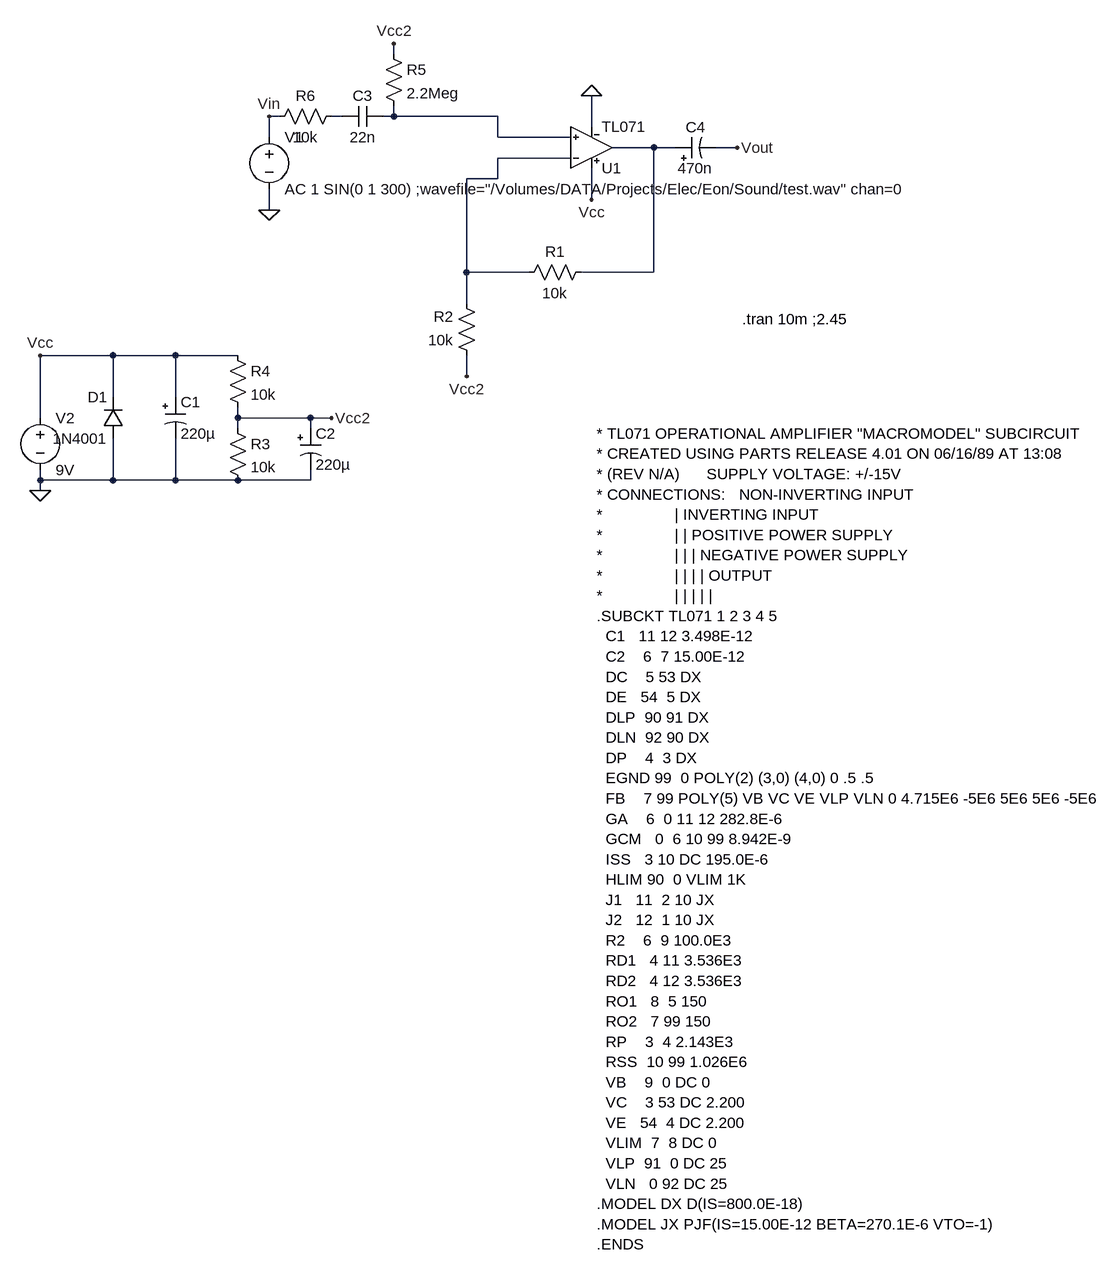
[diagram p0: schematic By2.asc]
By2.asc, the LTspice schematic file:
Version 4
SHEET 1 1308 1608
WIRE 224 128 224 112
WIRE 48 224 32 224
WIRE 144 224 128 224
WIRE 224 224 224 208
WIRE 224 224 208 224
WIRE 384 224 224 224
WIRE 528 240 528 192
WIRE 32 256 32 224
WIRE 384 256 384 224
WIRE 496 256 384 256
WIRE 624 272 560 272
WIRE 656 272 624 272
WIRE 752 272 720 272
WIRE 496 288 384 288
WIRE 384 320 384 288
WIRE 384 320 336 320
WIRE 528 352 528 304
WIRE 32 368 32 336
WIRE 336 464 336 320
WIRE 432 464 336 464
WIRE 624 464 624 272
WIRE 624 464 512 464
WIRE 336 512 336 464
WIRE -208 592 -320 592
WIRE -112 592 -208 592
WIRE -16 592 -112 592
WIRE 336 624 336 592
WIRE -208 656 -208 592
WIRE -112 656 -112 592
WIRE -320 688 -320 592
WIRE -16 688 -16 672
WIRE 96 688 -16 688
WIRE 128 688 96 688
WIRE -16 704 -16 688
WIRE 96 704 96 688
WIRE -320 784 -320 768
WIRE -208 784 -208 720
WIRE -208 784 -320 784
WIRE -112 784 -112 720
WIRE -112 784 -208 784
WIRE -16 784 -112 784
WIRE 96 784 96 768
WIRE 96 784 -16 784
WIRE -320 800 -320 784
FLAG 32 368 0
FLAG -320 800 0
FLAG -320 592 Vcc
FLAG 528 192 0
FLAG 528 352 Vcc
FLAG 752 272 Vout
FLAG 32 224 Vin
FLAG 336 624 Vcc2
FLAG 128 688 Vcc2
FLAG 224 112 Vcc2
SYMBOL voltage 32 240 R0
SYMATTR InstName V1
SYMATTR Value AC 1 SIN(0 1 300) ;wavefile="/Volumes/DATA/Projects/Elec/Eon/Sound/test.wav" chan=0
SYMBOL voltage -320 672 R0
SYMATTR InstName V2
SYMATTR Value 9V
SYMBOL res 528 448 R90
WINDOW 0 0 56 VBottom 2
WINDOW 3 32 56 VTop 2
SYMATTR InstName R1
SYMATTR Value 10k
SYMBOL res 352 608 R180
WINDOW 0 36 76 Left 2
WINDOW 3 36 40 Left 2
SYMATTR InstName R2
SYMATTR Value 10k
SYMBOL res -32 688 R0
SYMATTR InstName R3
SYMATTR Value 10k
SYMBOL res -32 576 R0
SYMATTR InstName R4
SYMATTR Value 10k
SYMBOL res 208 112 R0
SYMATTR InstName R5
SYMATTR Value 2.2Meg
SYMBOL res 144 208 R90
WINDOW 0 0 56 VBottom 2
WINDOW 3 32 56 VTop 2
SYMATTR InstName R6
SYMATTR Value 10k
SYMBOL diode -192 720 R180
WINDOW 0 24 64 Left 2
WINDOW 3 24 0 Left 2
SYMATTR InstName D1
SYMATTR Value 1N4001
SYMBOL polcap -128 656 R0
SYMATTR InstName C1
SYMATTR Value 220µ
SYMBOL polcap 80 704 R0
SYMATTR InstName C2
SYMATTR Value 220µ
SYMBOL cap 208 208 R90
WINDOW 0 0 32 VBottom 2
WINDOW 3 32 32 VTop 2
SYMATTR InstName C3
SYMATTR Value 22n
SYMBOL polcap 656 288 R270
WINDOW 0 32 32 VTop 2
WINDOW 3 0 32 VBottom 2
SYMATTR InstName C4
SYMATTR Value 470n
SYMBOL TL071bis 528 336 M180
SYMATTR InstName U1
SYMATTR SpiceModel ""
TEXT 760 536 Left 2 !.tran 10m ;2.45
TEXT 536 712 Left 2 !* TL071 OPERATIONAL AMPLIFIER "MACROMODEL" SUBCIRCUIT\n* CREATED USING PARTS RELEASE 4.01 ON 06/16/89 AT 13:08\n* (REV N/A)      SUPPLY VOLTAGE: +/-15V\n* CONNECTIONS:   NON-INVERTING INPUT\n*                | INVERTING INPUT\n*                | | POSITIVE POWER SUPPLY\n*                | | | NEGATIVE POWER SUPPLY\n*                | | | | OUTPUT\n*                | | | | |\n.SUBCKT TL071 1 2 3 4 5\n  C1   11 12 3.498E-12\n  C2    6  7 15.00E-12\n  DC    5 53 DX\n  DE   54  5 DX\n  DLP  90 91 DX\n  DLN  92 90 DX\n  DP    4  3 DX\n  EGND 99  0 POLY(2) (3,0) (4,0) 0 .5 .5\n  FB    7 99 POLY(5) VB VC VE VLP VLN 0 4.715E6 -5E6 5E6 5E6 -5E6\n  GA    6  0 11 12 282.8E-6\n  GCM   0  6 10 99 8.942E-9\n  ISS   3 10 DC 195.0E-6\n  HLIM 90  0 VLIM 1K\n  J1   11  2 10 JX\n  J2   12  1 10 JX\n  R2    6  9 100.0E3\n  RD1   4 11 3.536E3\n  RD2   4 12 3.536E3\n  RO1   8  5 150\n  RO2   7 99 150\n  RP    3  4 2.143E3\n  RSS  10 99 1.026E6\n  VB    9  0 DC 0\n  VC    3 53 DC 2.200\n  VE   54  4 DC 2.200\n  VLIM  7  8 DC 0\n  VLP  91  0 DC 25\n  VLN   0 92 DC 25\n.MODEL DX D(IS=800.0E-18)\n.MODEL JX PJF(IS=15.00E-12 BETA=270.1E-6 VTO=-1)\n.ENDS

The netlist it stands for:
* By2.asc
V1 Vin 0 AC 1 SIN(0 1 300) ;wavefile="/Volumes/DATA/Projects/Elec/Eon/Sound/test.wav" chan=0
V2 Vcc 0 9V
R1 N003 N004 10k
R2 Vcc2 N004 10k
R3 Vcc2 0 10k
R4 Vcc Vcc2 10k
R5 Vcc2 N002 2.2Meg
R6 N001 Vin 10k
D1 0 Vcc 1N4001
C1 Vcc 0 220µ
C2 Vcc2 0 220µ
C3 N002 N001 22n
C4 N003 Vout 470n
XU1 N002 N004 Vcc 0 N003 TL071  ; pins In+ In- V+ V- OUT
.model D D
.lib standard.dio
.tran 10m ;2.45
* TL071 OPERATIONAL AMPLIFIER "MACROMODEL" SUBCIRCUIT
* CREATED USING PARTS RELEASE 4.01 ON 06/16/89 AT 13:08
* (REV N/A)      SUPPLY VOLTAGE: +/-15V
* CONNECTIONS:   NON-INVERTING INPUT
*                | INVERTING INPUT
*                | | POSITIVE POWER SUPPLY
*                | | | NEGATIVE POWER SUPPLY
*                | | | | OUTPUT
*                | | | | |
.SUBCKT TL071 1 2 3 4 5
  C1   11 12 3.498E-12
  C2    6  7 15.00E-12
  DC    5 53 DX
  DE   54  5 DX
  DLP  90 91 DX
  DLN  92 90 DX
  DP    4  3 DX
  EGND 99  0 POLY(2) (3,0) (4,0) 0 .5 .5
  FB    7 99 POLY(5) VB VC VE VLP VLN 0 4.715E6 -5E6 5E6 5E6 -5E6
  GA    6  0 11 12 282.8E-6
  GCM   0  6 10 99 8.942E-9
  ISS   3 10 DC 195.0E-6
  HLIM 90  0 VLIM 1K
  J1   11  2 10 JX
  J2   12  1 10 JX
  R2    6  9 100.0E3
  RD1   4 11 3.536E3
  RD2   4 12 3.536E3
  RO1   8  5 150
  RO2   7 99 150
  RP    3  4 2.143E3
  RSS  10 99 1.026E6
  VB    9  0 DC 0
  VC    3 53 DC 2.200
  VE   54  4 DC 2.200
  VLIM  7  8 DC 0
  VLP  91  0 DC 25
  VLN   0 92 DC 25
.MODEL DX D(IS=800.0E-18)
.MODEL JX PJF(IS=15.00E-12 BETA=270.1E-6 VTO=-1)
.ENDS
.backanno
.end